# Altium schematic sheet LCD.SchDoc
size 420 x 297 mm; Date: 22.03.2024; ApprovedBy: Arda B.; CheckedBy: Arda B.; DrawnBy: Arda Bozkurt; Revision: 001; SheetNumber: 7; SheetTotal: 9; Size: A3; Department: HDD; DOC_NO_ASSY_: __; Time: 22.03.2024
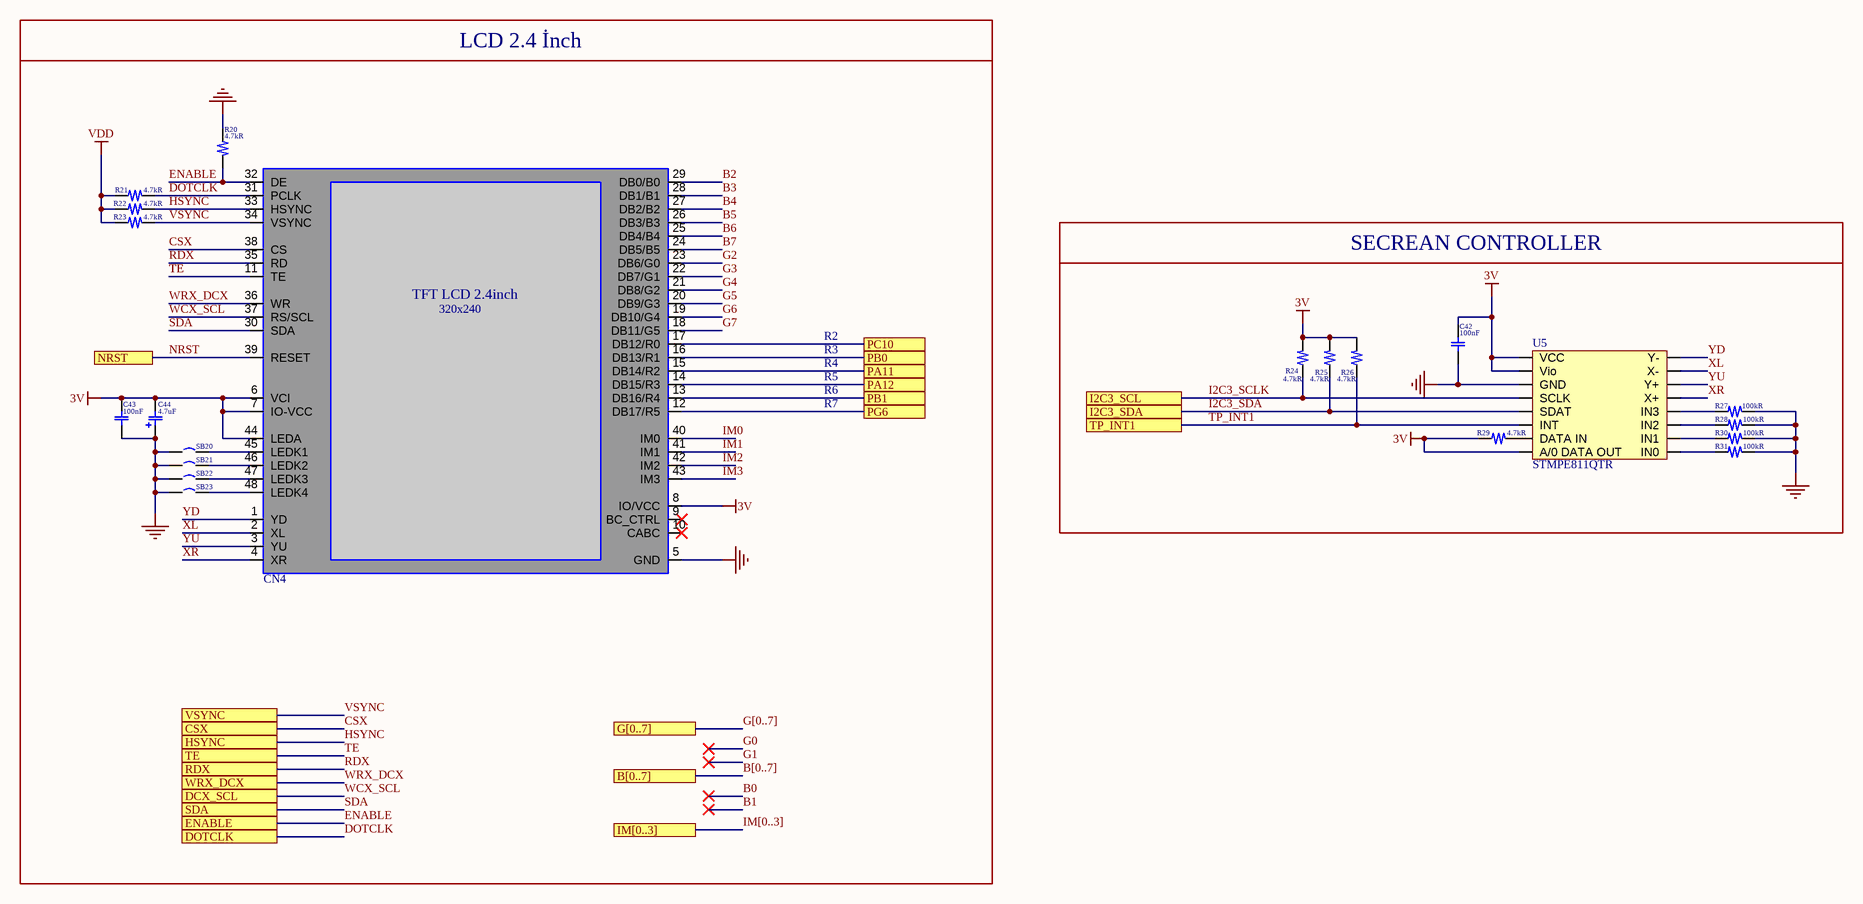
[diagram p0: LCD.SchDoc]

## Parts
C42  value 100nF  [CAP-0402]  (hidden comment: CC0402KRX7R7BB104)
C43  value 100nF  [CAP-0402]  (hidden comment: CC0402KRX7R7BB104)
C44  value 4.7uF  [CAP-TANT]  (hidden comment: TCJK475M010R0300)
CN4  FRD240C48003-B  [LED 2.54 inch]  (value not drawn)
R20  value 4.7kR  [RES-0402]  (hidden comment: RC0402FR-074K7L)
R21  value 4.7kR  [RES-0402]  (hidden comment: RC0402FR-074K7L)
R22  value 4.7kR  [RES-0402]  (hidden comment: RC0402FR-074K7L)
R23  value 4.7kR  [RES-0402]  (hidden comment: RC0402FR-074K7L)
R24  value 4.7kR  [RES-0402]  (hidden comment: RC0402FR-074K7L)
R25  value 4.7kR  [RES-0402]  (hidden comment: RC0402FR-074K7L)
R26  value 4.7kR  [RES-0402]  (hidden comment: RC0402FR-074K7L)
R27  value 100kR  [RES-0402]  (hidden comment: RC0402FR-07100KL)
R28  value 100kR  [RES-0402]  (hidden comment: RC0402FR-07100KL)
R29  value 4.7kR  [RES-0402]  (hidden comment: RC0402FR-074K7L)
R30  value 100kR  [RES-0402]  (hidden comment: RC0402FR-07100KL)
R31  value 100kR  [RES-0402]  (hidden comment: RC0402FR-07100KL)
SB20  RC0402JR-070RL  [RES-0402]  (value not drawn)
SB21  RC0402JR-070RL  [RES-0402]  (value not drawn)
SB22  RC0402JR-070RL  [RES-0402]  (value not drawn)
SB23  RC0402JR-070RL  [RES-0402]  (value not drawn)
U5  STMPE811QTR  [QFN16]

## Blocks framed on the sheet
LCD 2.4 İnch: C43 C44 CN4 R20-R23 SB20-SB23

## Ports
B[0..7] (see TOP[5A], Micro Controller[4B]), CSX (see TOP[4A], Micro Controller[5A]), DCX_SCL (see TOP[4A], Micro Controller[5B]), DOTCLK (see TOP[4A], Micro Controller[5B]), ENABLE (see TOP[4A], Micro Controller[5B]), G[0..7] (see TOP[5A], Micro Controller[4B]), HSYNC (see TOP[4A], Micro Controller[5A]), I2C3_SCL (see TOP[5A], MEMS Motion Sensor[4B], Micro Controller[5B]), I2C3_SDA (see TOP[5A], MEMS Motion Sensor[4B], Micro Controller[5B]), IM[0..3] (see TOP[5A], Micro Controller[4B]), NRST (see TOP[4A], MEMS Motion Sensor[3C], Micro Controller[2C]), PA11 (see TOP[5A], Micro Controller[4A]), PA12 (see TOP[5A], Micro Controller[4A]), PB0 (see TOP[5A], Micro Controller[4A]), PB1 (see TOP[5A], Micro Controller[4A]), PC10 (see TOP[5A], Micro Controller[4A]), PG6 (see TOP[5A], Micro Controller[4A]), RDX (see TOP[4A], Micro Controller[5B]), SDA (see TOP[4A], Micro Controller[5B]), TE (see TOP[4A], Micro Controller[5B]), TP_INT1 (see TOP[5A], Micro Controller[5B]), VSYNC (see TOP[4A], Micro Controller[5A]), WRX_DCX (see TOP[4A], Micro Controller[5B])

## Nets
3V: C42.2 C43.2 C44.2 CN4.6(VCI) CN4.7(IO-VCC) CN4.8(IO/VCC) CN4.44(LEDA) R24.2 R25.2 R26.2 R29.1 U5.3(A/0_DATA_OUT) U5.6(VCC) U5.14(Vio)
GND: C42.1 C43.1 C44.1 CN4.5(GND) R20.1 R27.2 R28.2 R30.2 R31.2 SB20.1 SB21.1 SB22.1 SB23.1 U5.10(GND)
VDD: R21.1 R22.1 R23.1
B2: CN4.29(DB0/B0)
B3: CN4.28(DB1/B1)
B4: CN4.27(DB2/B2)
B5: CN4.26(DB3/B3)
B6: CN4.25(DB4/B4)
B7: CN4.24(DB5/B5)
CSX: CN4.38(CS) ; port CSX
DOTCLK: CN4.31(PCLK) R21.2 ; port DOTCLK
ENABLE: CN4.32(DE) R20.2 ; port ENABLE
G2: CN4.23(DB6/G0)
G3: CN4.22(DB7/G1)
G4: CN4.21(DB8/G2)
G5: CN4.20(DB9/G3)
G6: CN4.19(DB10/G4)
G7: CN4.18(DB11/G5)
HSYNC: CN4.33(HSYNC) R22.2 ; port HSYNC
I2C3_SCLK: R24.1 U5.4(SCLK) ; port I2C3_SCL
I2C3_SDA: R25.1 U5.5(SDAT) ; port I2C3_SDA
IM0: CN4.40(IM0)
IM1: CN4.41(IM1)
IM2: CN4.42(IM2)
IM3: CN4.43(IM3)
NRST: CN4.39(RESET) ; port NRST
PA11: CN4.15(DB14/R2) ; port PA11
PA12: CN4.14(DB15/R3) ; port PA12
PB0: CN4.16(DB13/R1) ; port PB0
PB1: CN4.13(DB16/R4) ; port PB1
PC10: CN4.17(DB12/R0) ; port PC10
PG6: CN4.12(DB17/R5) ; port PG6
RDX: CN4.35(RD) ; port RDX
SDA: CN4.30(SDA) ; port SDA
TE: CN4.11(TE) ; port TE
TP_INT1: R26.1 U5.2(INT) ; port TP_INT1
VSYNC: CN4.34(VSYNC) R23.2 ; port VSYNC
WCX_SCL: CN4.37(RS/SCL) ; port DCX_SCL
WRX_DCX: CN4.36(WR) ; port WRX_DCX
XL: CN4.2(XL) U5.16(X-)
XR: CN4.4(XR) U5.13(X+)
YD: CN4.1(YD) U5.1(Y-)
YU: CN4.3(YU) U5.15(Y+)
NetCN4_45: CN4.45(LEDK1) SB20.2
NetCN4_46: CN4.46(LEDK2) SB21.2
NetCN4_47: CN4.47(LEDK3) SB22.2
NetCN4_48: CN4.48(LEDK4) SB23.2
NetR27_1: R27.1 U5.12(IN3)
NetR28_1: R28.1 U5.11(IN2)
NetR29_2: R29.2 U5.7(DATA_IN)
NetR30_1: R30.1 U5.9(IN1)
NetR31_1: R31.1 U5.8(IN0)

Not connected (* = marked no-connect by the designer): CN4 9(BC_CTRL)* 10(CABC)*

## Buses and harness runs
bus B[0..7] = port B[0..7]
bus G[0..7] = port G[0..7]
bus IM[0..3] = port IM[0..3]

## Notes on the sheet
- SECREAN CONTROLLER
- R2
- R3
- R4
- R5
- R6
- R7
- REVİSİON
- DESCRIPTION
- DATE
- APPROVED
- DWG NO:
- TAINIM/DESCRIPTION
- REV:
- DOSYA ADI/FİLE NAME
- HAZIRLAYAN/PREPARED BY
- KONTROL EDEN/ CHECKED BY
- YAYIN TARİHİ/REL. DATE
- DEĞ TARİHİ/CHANCE DATE
- ONAYLAYAN/APPROVED BY
- REVİZYON/REVISION
- Arda Bozkurt
- BÖLÜM/DEPARTMENT
- BOYUT/SİZE
- SAYFA/SHEET
- of
- (in symbol LCD 320X240 2.54ınc) TFT LCD 2.4inch; 320x240

## Library data of the parts
C42 C43 = CAP CER 100nF 16V X7R 0402: Multilayer Ceramic Capacitor, 0.1 uF, 25 V, ± 10%, X7R, 0402 [1005 Metric]; Manufacturer: Yageo; Material: 4241ConductorMaterial; Voltage Rating: 16V; Temperature Coefficient: 30ppm/°C; Supplier: Future Electronics; Supplier Part Number: 8517856; Manufacturer Part Number: CC0402KRX7R7BB104; RoHS: Yes; Category: Ceramic Capacitors; Stock: 30330000; Pricing: 10000=0,0028, 40000=0,0027, 150000=0,0025, 300000=0,0025, 750000=0,0023 (USD); Mounting Technology: Surface Mount; Case/Package: 0402; Pins: 2; Case Code (Metric): 1005; Case Code (Imperial): 0402; Min Operating Temperature: -55°C; Max Operating Temperature: 125°C; Tolerance: 10%; Dielectric: X7R; Voltage Rating (DC): 16V; Packaging: Tape and Reel; Package Quantity: 1; Termination: SMD/SMT; Voltage: 16V; Series: CC; Voltage Rating (AC): 16V; Length: 1mm; Width: 0.02inch; Height: 0.5mm; Thickness: 0.022inch; Depth: 0.5mm; Radiation Hardening: No; RoHS Compliant: Yes; Reach SVHC Compliant: No; Halogen Free: 5694HalogenFree; Lead Free: 5697LeadFree; ComponentLink1URL: https://datasheet.ciiva.com/11788/0900766b80ce67ed-11788364.pdf?src-supplier=Rs; ComponentLink1Description: https://datasheet.ciiva.com/11788/0900766b80ce67ed-11788364.pdf?src-supplier=Rs; ComponentLink2URL: https://datasheet.ciiva.com/7978/1489800-7978111.pdf?src-supplier=Element14; ComponentLink2Description: https://datasheet.ciiva.com/7978/1489800-7978111.pdf?src-supplier=Element14; ComponentLink3URL: https://datasheet.ciiva.com/161/mlccorderingcode-161545.pdf?src-supplier=Digikey; ComponentLink3Description: https://datasheet.ciiva.com/161/mlccorderingcode-161545.pdf?src-supplier=Digikey; ComponentLink4URL: https://datasheet.ciiva.com/161/mlccorderingcode-161544.pdf?src-supplier=Digikey; ComponentLink4Description: https://datasheet.ciiva.com/161/mlccorderingcode-161544.pdf?src-supplier=Digikey; ComponentLink5URL: https://datasheet.ciiva.com/161/mlccorderingcode-161546.pdf?src-supplier=Digikey; ComponentLink5Description: https://datasheet.ciiva.com/161/mlccorderingcode-161546.pdf?src-supplier=Digikey; ComponentLink6URL: https://datasheet.ciiva.com/8033/1734573-8033661.pdf?src-supplier=Element14; ComponentLink6Description: https://datasheet.ciiva.com/8033/1734573-8033661.pdf?src-supplier=Element14; ComponentLink7URL: https://datasheet.ciiva.com/11587/upy-gphc-x7r-6-3v-to-50v-8-11587305.pdf?src-supplier=Avnet; ComponentLink7Description: https://datasheet.ciiva.com/11587/upy-gphc-x7r-6-3v-to-50v-8-11587305.pdf?src-supplier=Avnet; ComponentLink8URL: https://datasheet.ciiva.com/28450/1489800-28450335.pdf?src-supplier=Element14; ComponentLink8Description: https://datasheet.ciiva.com/28450/1489800-28450335.pdf?src-supplier=Element14; ComponentLink9URL: https://datasheet.ciiva.com/13395/upy-gphc-x7r-6-3v-to-50v-8-13395676.pdf?src-supplier=Mouser; ComponentLink9Description: https://datasheet.ciiva.com/13395/upy-gphc-x7r-6-3v-to-50v-8-13395676.pdf?src-supplier=Mouser; ComponentLink10URL: https://datasheet.ciiva.com/8033/1734573-8033663.pdf?src-supplier=Element14; ComponentLink10Description: https://datasheet.ciiva.com/8033/1734573-8033663.pdf?src-supplier=Element14
C44 = C-TANT POLY 4.7UF 10V 1206: Cap Tant Polymer 4.7uF 10V K CASE 20% (3.2 x 1.6 x 1mm) SMD 300m Ohm 105°C T/R; Manufacturer: Kyocera AVX; Manufacturer Part Number: TCJK475M010R0300E; Supplier: Avnet; Supplier Part Number: TCJK475M010R0300E; RoHS: Yes; Pricing: 3000=0,72395 (USD)
CN4 = LCD 320X240 2.54ınc: Interface: SPI/MCU/SPI_RGB; Min Power supply voltage: 0.3V; Max Power supply voltage: 4.6V; High Temperature Storage: 70 ℃, 48 hrs; Low Temperature Storage: -20 ℃, 48 hrs; Screen Size: 2.4inch; Resolution: 240 × RGB ×320; Active Area: 36.72*48.96 mm; ComponentLink1Description: DataSheet; ComponentLink1URL: https://community.st.com/ysqtg83639/attachments/ysqtg83639/mcu-touch-gfx-gui-forum/1401/1/FRIDA_LCD_FRD240C48003-B.pdf; Outline Dimension: 42.72*60.26*3.55 mm
R20-R26 R29 = RES 4.7K OHM 1% 1/16W 0402: SMD Chip Resistor, 4.7 kOhm, ± 1%, 63 mW, 0402 [1005 Metric], Thick Film, General Purpose; Manufacturer: Yageo; Voltage Rating (DC): 50V; Power Rating: 62.5mW; Temperature Coefficient: 100ppm/°C; Max Power Dissipation: 63mW; Supplier: Future Electronics; Supplier Part Number: 3795218; Manufacturer Part Number: RC0402FR-074K7L; RoHS: Yes; Category: Chip SMD Resistors; Stock: 7100000; Pricing: 10000=0,0012, 100000=0,0011, 300000=0,001, 750000=0,001, 2000000=0,0009 (USD); Case/Package: 0402; Pins: 2; Case Code (Imperial): 0402; Case Code (Metric): 1005; Min Operating Temperature: -55°C; Max Operating Temperature: 155°C; Tolerance: 1%; Voltage Rating: 50V; Packaging: Tape and Reel; Resistor Type: Thick Film; Termination: SMD/SMT; Features: Moisture Resistant; Series: RC; Number of Terminations: 2; Resistance Tolerance: 1%; Construction: Rectangular; Voltage Rating (AC): 50V; Length: 1mm; Width: 0.5mm; Depth: 0.5mm; RoHS Compliant: Yes; Reach SVHC Compliant: No; Military Standard: Not; Lead Free: Lead Free; ComponentLink1URL: https://datasheet.ciiva.com/22661/1686128-22661342.pdf?src-supplier=Element14; ComponentLink1Description: https://datasheet.ciiva.com/22661/1686128-22661342.pdf?src-supplier=Element14; ComponentLink2URL: https://datasheet.ciiva.com/7850/1018594-7850022.pdf?src-supplier=Element14; ComponentLink2Description: https://datasheet.ciiva.com/7850/1018594-7850022.pdf?src-supplier=Element14; ComponentLink3URL: https://datasheet.ciiva.com/7850/1018594-7850023.pdf?src-supplier=Element14; ComponentLink3Description: https://datasheet.ciiva.com/7850/1018594-7850023.pdf?src-supplier=Element14; ComponentLink4URL: https://datasheet.ciiva.com/15215/getdatasheetpartid-328119-15215035.pdf?src-supplier=Verical; ComponentLink4Description: https://datasheet.ciiva.com/15215/getdatasheetpartid-328119-15215035.pdf?src-supplier=Verical
R27 R28 R30 R31 = RES 100K OHM 1% 1/16W 0402: SMD Chip Resistor, 100 kOhm, ± 1%, 63 mW, 0402 [1005 Metric], Thick Film, General Purpose; Manufacturer: Yageo; Temperature Coefficient: 100ppm/°C; Power Rating: 63mW; Voltage Rating: 50V; Supplier: Future Electronics; Supplier Part Number: 6468466; Manufacturer Part Number: RC0402FR-07100KL; RoHS: Yes; Category: Chip SMD Resistors; Stock: 35770000; Pricing: 10000=0,0019, 100000=0,0018, 300000=0,0017, 750000=0,0016, 2000000=0,0015 (USD); Case/Package: 0402; Case Code (Metric): 1005; Case Code (Imperial): 0402; Min Operating Temperature: -55°C; Max Operating Temperature: 155°C; Resistor Type: Thick Film; Tolerance: 1%; Packaging: Tape and Reel; Package Quantity: 1; Number of Terminations: 2; Termination: SMD/SMT; Max Power Dissipation: 63mW; Features: Moisture Resistant; Series: RC; Resistance Tolerance: 1%; Construction: Rectangular; Technology: THICK FILM; Voltage Rating (AC): 50V; Length: 0.039inch; Width: 0.02inch; Height: 0.016inch; Depth: 0.5mm; Reach SVHC Compliant: No; RoHS Compliant: Yes; Lead Free: 5697LeadFree; Military Standard: Not; ComponentLink1URL: https://datasheet.ciiva.com/11819/0900766b80c66297-11819452.pdf?src-supplier=Rs; ComponentLink1Description: https://datasheet.ciiva.com/11819/0900766b80c66297-11819452.pdf?src-supplier=Rs; ComponentLink2URL: https://datasheet.ciiva.com/22747/1018594-22747509.pdf?src-supplier=Element14; ComponentLink2Description: https://datasheet.ciiva.com/22747/1018594-22747509.pdf?src-supplier=Element14; ComponentLink3URL: https://datasheet.ciiva.com/2453/pyu-r-int-thick-7-2453362.pdf?src-supplier=Digikey; ComponentLink3Description: https://datasheet.ciiva.com/2453/pyu-r-int-thick-7-2453362.pdf?src-supplier=Digikey; ComponentLink4URL: https://datasheet.ciiva.com/2453/pyu-r-int-thick-7-2453363.pdf?src-supplier=Digikey; ComponentLink4Description: https://datasheet.ciiva.com/2453/pyu-r-int-thick-7-2453363.pdf?src-supplier=Digikey; ComponentLink5URL: https://datasheet.ciiva.com/2453/pyu-r-int-thick-7-2453361.pdf?src-supplier=Digikey; ComponentLink5Description: https://datasheet.ciiva.com/2453/pyu-r-int-thick-7-2453361.pdf?src-supplier=Digikey; ComponentLink6URL: https://datasheet.ciiva.com/12667/pyu-rc0402-51-rohs-l-6-r-12667930.pdf?src-supplier=Mouser; ComponentLink6Description: https://datasheet.ciiva.com/12667/pyu-rc0402-51-rohs-l-6-r-12667930.pdf?src-supplier=Mouser; ComponentLink7URL: https://datasheet.ciiva.com/15189/getdatasheetpartid-323696-15189334.pdf?src-supplier=Verical; ComponentLink7Description: https://datasheet.ciiva.com/15189/getdatasheetpartid-323696-15189334.pdf?src-supplier=Verical
SB20-SB23 = RES 0 OHM JUMPER 1/10W 0603: Zero Ohm Resistor, Jumper, 0402 [1005 Metric], Thick Film, 62.5 mW, 1 A, Surface Mount; Manufacturer: Yageo; Manufacturer Part Number: RC0603JR-070RL; Tolerance: 1%; Power Rating: 100mW; Voltage Rating (DC): 50V; Temperature Coefficient: 200ppm/°C; Resistance Tolerance: 5%; Value: 0mR; Supplier: Future Electronics; Supplier Part Number: 3992146; RoHS: Yes; Category: Chip SMD Resistors; Stock: 16200000; Pricing: 5000=0,0016, 50000=0,0014, 100000=0,0015, 150000=0,0014, 375000=0,0014, 1000000=0,0012, 1250000=0,0013, 5000000=0,0012 (USD); Case/Package: 0603; Pins: 2; Contact Plating: Tin,Matte; Case Code (Imperial): 0402; Case Code (Metric): 1608; Min Operating Temperature: -55°C; Max Operating Temperature: 155°C; Resistor Type: Thick Film; Packaging: Tape and Reel; Termination: SMD/SMT; Series: RC; Technology: THICK FILM; Package Quantity: 5000; Voltage Rating: 50V; Features: Moisture Resistant; Max Power Dissipation: 100mW; Number of Terminations: 2; Construction: Rectangular; Length: 1.6mm; Width: 0.8mm; Height: 0.45mm; Depth: 0.8mm; RoHS Compliant: Yes; Reach SVHC Compliant: Unknown; Lead Free: 5697LeadFree; Military Standard: Not
U5 = IC SCREEN CNTRL 12BIT 16QFN: S-Touch® advanced resistive touchscreen controller with 8-bit GPIO expander; Manufacturer: STMicroelectronics; Supplier: Future Electronics; Supplier Part Number: 5046233; Manufacturer Part Number: STMPE811QTR; RoHS: Yes; Category: Touch Screen Controllers; Pricing: 4000=2,12 (USD); ComponentLink1URL: https://datasheet.ciiva.com/4826/cd00186725-116780-4826797.pdf?src-supplier=Mouser; ComponentLink1Description: https://datasheet.ciiva.com/4826/cd00186725-116780-4826797.pdf?src-supplier=Mouser